# EAGLE design Lora- 4 Channel MOSFET Driver V1.1 (EAGLE 6.1)
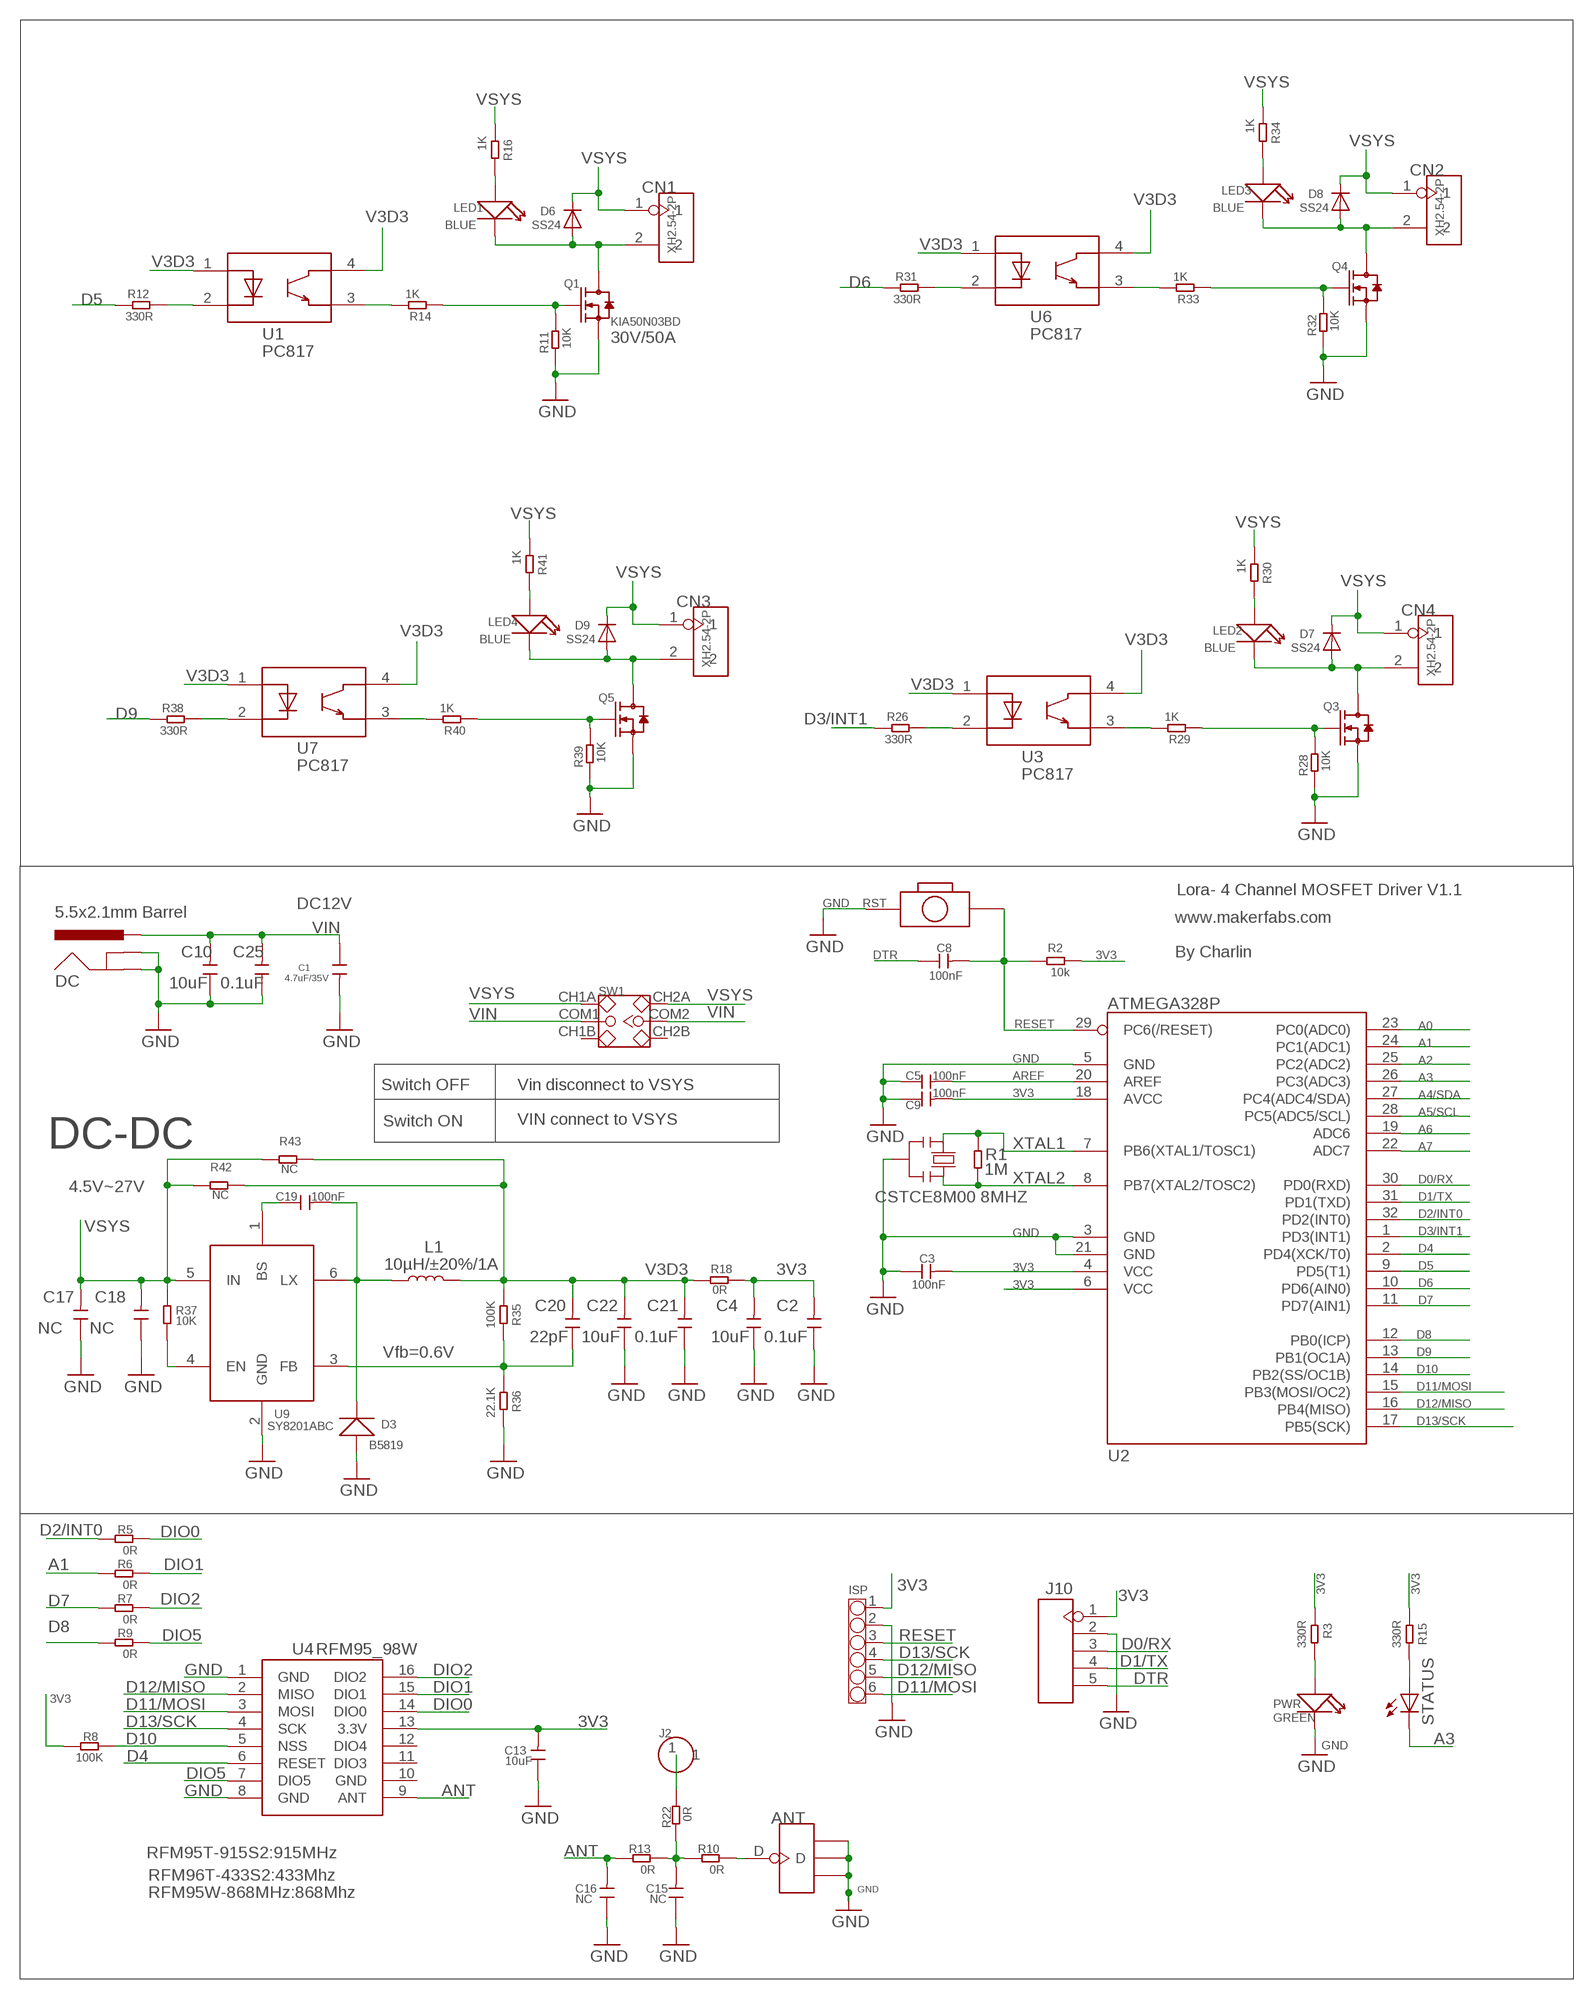
[diagram p0: schematic, sheet 1]

## Parts
ANT  ANTENNA-U-FL  [4P-U-FL]
C1  4.7uF/35V  C-0603  [0603]
C2  0.1uF  C-0603  [0603]
C3  100nF  C-0603  [0603]
C4  10uF  C-0603  [0603]
C5  100nF  C-0603  [0603]
C8  100nF  C-0603  [0603]
C9  100nF  C-0603  [0603]
C10  10uF  C-0603  [0603]
C13  10uF  C-0603  [0603]
C15  NC  C-0603  [0603]
C16  NC  C-0603  [0603]
C17  NC  C-0603  [0603]
C18  NC  C-0603  [0603]
C19  100nF  C-0603  [0603]
C20  22pF  C-0603  [0603]
C21  0.1uF  C-0603  [0603]
C22  10uF  C-0603  [0603]
C25  0.1uF  C-0603  [0603]
CN1  XH2.54-2P  [XH2.54-2P]
CN2  XH2.54-2P  [XH2.54-2P]
CN3  XH2.54-2P  [XH2.54-2P]
CN4  XH2.54-2P  [XH2.54-2P]
D3  B5819  D'1206'  [SOD123]
D6  SS24  DIODESMA  [SMADIODE]
D7  SS24  DIODESMA  [SMADIODE]
D8  SS24  DIODESMA  [SMADIODE]
D9  SS24  DIODESMA  [SMADIODE]
DC  5.5x2.1mm Barrel  POWER_JACKSMD  [POWER_JACK_SMD]
ISP  CONNECTOR-HEADER-6P-3460270P1  [1X6P-2.54-8.5-BLACK-FEMALE]
J2  HEADER-1P-50  [1P-100/50MIL]
J10  HEADER-5P-2.54  [5P-2.54]
L1  10µH/±20%/1A  INDUCTOR-SRN6045-33UH  [SRN6045]
LED1  BLUE  LED'0603'  [LED-0603]
LED2  BLUE  LED'0603'  [LED-0603]
LED3  BLUE  LED'0603'  [LED-0603]
LED4  BLUE  LED'0603'  [LED-0603]
PWR  GREEN  LED'0603'  [LED-0603]
Q1  KIA50N03BD  DISCRETE_MOSFET-NP3055LDG  [DISCRETE_TO252]
Q3  DISCRETE_MOSFET-NP3055LDG  [DISCRETE_TO252]
Q4  DISCRETE_MOSFET-NP3055LDG  [DISCRETE_TO252]
Q5  DISCRETE_MOSFET-NP3055LDG  [DISCRETE_TO252]
R1  1M  R-0603  [R0603]
R2  10k  R-0603  [R0603]
R3  330R  R-0603  [R0603]
R5  0R  R-0603  [R0603]
R6  0R  R-0603  [R0603]
R7  0R  R-0603  [R0603]
R8  100K  R-0603  [R0603]
R9  0R  R-0603  [R0603]
R10  0R  R-0603  [R0603]
R11  10K  R-0603  [R0603]
R12  330R  R-0603  [R0603]
R13  0R  R-0603  [R0603]
R14  1K  R-0603  [R0603]
R15  330R  R-0603  [R0603]
R16  1K  R-0603  [R0603]
R18  0R  R-0603  [R0603]
R22  0R  R-0603  [R0603]
R26  330R  R-0603  [R0603]
R28  10K  R-0603  [R0603]
R29  1K  R-0603  [R0603]
R30  1K  R-0603  [R0603]
R31  330R  R-0603  [R0603]
R32  10K  R-0603  [R0603]
R33  1K  R-0603  [R0603]
R34  1K  R-0603  [R0603]
R35  100K  R-0603  [R0603]
R36  22.1K  R-0603  [R0603]
R37  10K  R-0603  [R0603]
R38  330R  R-0603  [R0603]
R39  10K  R-0603  [R0603]
R40  1K  R-0603  [R0603]
R41  1K  R-0603  [R0603]
R42  NC  R-0603  [R0603]
R43  NC  R-0603  [R0603]
RST  BOTTON-2P-90D  [2P-7.62X3.56-90D]
STATUS  LED5MM  [LED5MM]
SW1  SWITCH-2CH-6P  [6P-2CH-2.54-7.6X3.0]
U1  PC817  [SMD4-254P-1016L460W]
U2  ATMEGA328P  ATMEGA8/168/328  [TQFP32]
U3  PC817  [SMD4-254P-1016L460W]
U4  RFM95_98W  RFM92_93W  [RFM92_93W]
U6  PC817  [SMD4-254P-1016L460W]
U7  PC817  [SMD4-254P-1016L460W]
U9  SY8201ABC  [SOT-23-6]
Y1  CSTCE8M00 8MHZ  RESONATORMU  [RESONATOR]

## Nets
3V3: C2.2 C3.2 C4.2 C9.2 C13.2 ISP.1 J10.1 R2.1 R3.1 R8.2 R15.1 R18.2 U2.4(VCC) U2.6(VCC) U2.18(AVCC) U4.13(3.3V)
A0: U2.23(PC0(ADC0))
A1: R6.1 U2.24(PC1(ADC1))
A2: U2.25(PC2(ADC2))
A3: STATUS.K(C) U2.26(PC3(ADC3))
A4/SDA: U2.27(PC4(ADC4/SDA))
A5/SCL: U2.28(PC5(ADC5/SCL))
A6: U2.19(ADC6)
A7: U2.22(ADC7)
ANT: C16.2 R13.2 U4.9(ANT)
AREF: C5.2 U2.20(AREF)
D0/RX: J10.3 U2.30(PD0(RXD))
D1/TX: J10.4 U2.31(PD1(TXD))
D2/INT0: R5.1 U2.32(PD2(INT0))
D3/INT1: R26.1 U2.1(PD3(INT1))
D4: U2.2(PD4(XCK/T0)) U4.6(RESET)
D5: R12.1 U2.9(PD5(T1))
D6: R31.1 U2.10(PD6(AIN0))
D7: R7.1 U2.11(PD7(AIN1))
D8: R9.1 U2.12(PB0(ICP))
D9: R38.1 U2.13(PB1(OC1A))
D10: R8.1 U2.14(PB2(SS/OC1B)) U4.5(NSS)
D11/MOSI: ISP.6 U2.15(PB3(MOSI/OC2)) U4.3(MOSI)
D12/MISO: ISP.5 U2.16(PB4(MISO)) U4.2(MISO)
D13/SCK: ISP.4 U2.17(PB5(SCK)) U4.4(SCK)
DIO0: R5.2 U4.14(DIO0)
DIO1: R6.2 U4.15(DIO1)
DIO2: R7.2 U4.16(DIO2)
DIO5: R9.2 U4.7(DIO5)
DTR: C8.1 J10.5
GND: ANT.GND1 ANT.GND2 ANT.GND3 C1.2 C2.1 C3.1 C4.1 C5.1 C9.1 C10.1 C13.1 C15.1 C16.1 C17.1 C18.1 C21.1 C22.1 C25.1 D3.+ DC.GND(GNDBREAK) DC.P$4(GND) ISP.2 J10.2 PWR.- Q1.3(S) Q3.3(S) Q4.3(S) Q5.3(S) R11.1 R28.1 R32.1 R36.2 R39.1 RST.P$1 U2.3(GND) U2.5(GND) U2.21(GND) U4.1(GND) U4.8(GND) U9.2(GND) Y1.2
N$1: ANT.D R10.1
N$2: R12.2 U1.2
N$4: C15.2 R10.2 R13.1 R22.2
N$5: R15.2 STATUS.A
N$6: Q1.1(G) R11.2 R14.1
N$7: PWR.+ R3.2
N$12: J2.1 R22.1
N$13: CN1.2 D6.A LED1.- Q1.2(D)
N$14: R14.2 U1.3
N$18: R26.2 U3.2
N$19: Q3.1(G) R28.2 R29.1
N$20: LED1.+ R16.2
N$21: R29.2 U3.3
N$22: CN4.2 D7.A LED2.- Q3.2(D)
N$23: LED2.+ R30.2
N$25: R31.2 U6.2
N$26: C19.2 D3.- L1.1 U9.6(LX)
N$27: C19.1 U9.1(BS)
N$28: C20.1 R35.2 R36.1 U9.3(FB)
N$29: Q4.1(G) R32.2 R33.1
N$30: R33.2 U6.3
N$31: CN2.2 D8.A LED3.- Q4.2(D)
N$32: LED3.+ R34.2
N$33: R38.2 U7.2
N$34: Q5.1(G) R39.2 R40.1
N$35: R40.2 U7.3
N$36: CN3.2 D9.A LED4.- Q5.2(D)
N$37: LED4.+ R41.2
N$38: R37.2 U9.4(EN)
RESET: C8.2 ISP.3 R2.2 RST.P$2 U2.29(PC6(/RESET))
V3D3: C20.2 C21.2 C22.2 L1.2 R18.1 R35.1 R42.2 R43.2 U1.1 U1.4 U3.1 U3.4 U6.1 U6.4 U7.1 U7.4
VIN: C1.1 C10.2 C25.2 DC.VIN0(PWR) SW1.COM1 SW1.COM2
VSYS: C17.2 C18.2 CN1.1 CN2.1 CN3.1 CN4.1 D6.C D7.C D8.C D9.C R16.1 R30.1 R34.1 R37.1 R41.1 R42.1 R43.1 SW1.CH1A SW1.CH2A U9.5(IN)
XTAL1: R1.2 U2.7(PB6(XTAL1/TOSC1)) Y1.1
XTAL2: R1.1 U2.8(PB7(XTAL2/TOSC2)) Y1.3
Unconnected: SW1.CH1B SW1.CH2B U4.11(DIO3) U4.12(DIO4)

## Notes on the sheet
- 30V/50A
- Lora- 4 Channel MOSFET Driver V1.1
- DC12V
- www.makerfabs.com
- By Charlin
- Switch OFF | Vin disconnect to VSYS
- Switch ON | VIN connect to VSYS
- DC-DC
- 4.5V~27V
- Vfb=0.6V
- RFM95T-915S2:915MHz
- RFM96T-433S2:433Mhz
- RFM95W-868MHz:868Mhz

## Power pins joined to a net without a drawn wire
GND: U4.10(GND)

## Library data of the parts
ANT = Connector:ANTENNA-U-FL
C1-C5 C8-C10 C13 C15-C22 C25 = Discrete:C*: Ceramic Capacitors
CN1-CN4 = Connector:XH2.54-2P
D3 = Discrete:D*
D6-D9 = adafruit:DIODE: Diode SMADIODE - SMA Surface Mount Package 20V 1A Schottky Diode Digikey: 641-1014-6-ND DO-1N4148 - Through Hole Small Current Diode SOD-123 20V 1 A (.5mV Vf) Schottky Diode - Digikey: MBRX120TPMSCT-ND SOD-323 10V 570mA (.38mV Vf, 3ns) Schottky Diode - Digikey: ZLLS410CT-ND SOD-523 30V 30mA Schottky Diode (RB751S-40TE61) - Digikey: RB751S-40TE61CT-ND SOT23-R/W - SOT23 Package (R = Solder Paste/Reflow Ovens, W = Hand-Soldering) BAT54Film 40V 300mA - Digikey: 497-7162-1-ND
DC = SparkFun-Connectors:POWER_JACK: Power Jack Connector This is the standard 5.5mm barrel jack for power. The PTH is the most common, proven, reliable, footprint. The Slot footprint only works if the mill layer is transmitted to the PCB fab house so be warned. Here are the connectors we sell at SparkFun: DC Barrel Power Jack/Connector <https://www.sparkfun.com/products/119> (PRT-00119) DC Barrel Power Jack/Connector (SMD) <https://www.sparkfun.com/products/12748> (PRT-12748) DC Barrel Jack Adapter - Breadboard Compatible <https://www.sparkfun.com/products/10811> (PRT-10811) It is used on this SparkFun product (and many, many others): SparkFun RedBoard - Programmed with Arduino <https://www.sparkfun.com/products/12757> (DEV-12757) Also, if you need a mating power supply or connector, please check these out: Wall Adapter Power Supply - 9VDC 650mA <https://www.sparkfun.com/products/298> (TOL-00298) DC Barrel Jack Adapter - Male <https://www.sparkfun.com/products/10287> (PRT-10287); PROD_ID: CONN-08106; SF_ID: PRT-12748
ISP = OPL Eagle Library:CONNECTOR-HEADER-6P
J2 = Connector:HEADER-1P
J10 = Connector:HEADER-5P
L1 = SparkFun-Coils:INDUCTOR: Inductors Resist changes in electrical current. Basically a coil of wire. SparkFun Products: SparkFun Load Cell Amplifier - HX711 <https://www.sparkfun.com/products/13879> IOIO-OTG - V2.2 <https://www.sparkfun.com/products/13613>; PROD_ID: NDUC-11627; VALUE: 33µH/±20%/1.4A
LED1-LED4 PWR = Discrete:LED*
Q1 Q3-Q5 = A9G:DISCRETE_MOSFET-N: IRLL014: http://www.vishay.com/docs/91319/sihll014.pdf
R1-R3 R5-R16 R18 R22 R26 R28-R43 = Discrete:R*
RST = Discrete:BOTTON-2P
STATUS = led:LED: LED OSRAM: - CHIPLED LG R971, LG N971, LY N971, LG Q971, LY Q971, LO R971, LY R971 LH N974, LH R974 LS Q976, LO Q976, LY Q976 LO Q996 - Hyper CHIPLED LW Q18S LB Q993, LB Q99A, LB R99A - SideLED LS A670, LO A670, LY A670, LG A670, LP A670 LB A673, LV A673, LT A673, LW A673 LH A674 LY A675 LS A676, LA A676, LO A676, LY A676, LW A676 LS A679, LY A679, LG A679 - Hyper Micro SIDELED® LS Y876, LA Y876, LO Y876, LY Y876 LT Y87S - SmartLED LW L88C, LW L88S LB L89C, LB L89S, LG L890 LS L89K, LO L89K, LY L89K LS L896, LA L896, LO L896, LY L896 - TOPLED LS T670, LO T670, LY T670, LG T670, LP T670 LSG T670, LSP T670, LSY T670, LOP T670, LYG T670 LG T671, LOG T671, LSG T671 LB T673, LV T673, LT T673, LW T673 LH T674 LS T676, LA T676, LO T676, LY T676, LB T676, LH T676, LSB T676, LW T676 LB T67C, LV T67C, LT T67C, LS T67K, LO T67K, LY T67K, LW E67C LS E67B, LA E67B, LO E67B, LY E67B, LB E67C, LV E67C, LT E67C LW T67C LS T679, LY T679, LG T679 LS T770, LO T770, LY T770, LG T770, LP T770 LB T773, LV T773, LT T773, LW T773 LH T774 LS E675, LA E675, LY E675, LS T675 LS T776, LA T776, LO T776, LY T776, LB T776 LHGB T686 LT T68C, LB T68C - Hyper Mini TOPLED® LB M676 - Mini TOPLED Santana® LG M470 LS M47K, LO M47K, LY M47K Source: http://www.osram.convergy.de LUXEON: - LUMILED® LXK2-PW12-R00, LXK2-PW12-S00, LXK2-PW14-U00, LXK2-PW14-V00 LXK2-PM12-R00, LXK2-PM12-S00, LXK2-PM14-U00 LXK2-PE12-Q00, LXK2-PE12-R00, LXK2-PE12-S00, LXK2-PE14-T00, LXK2-PE14-U00 LXK2-PB12-K00, LXK2-PB12-L00, LXK2-PB12-M00, LXK2-PB14-N00, LXK2-PB14-P00, LXK2-PB14-Q00 LXK2-PR12-L00, LXK2-PR12-M00, LXK2-PR14-Q00, LXK2-PR14-R00 LXK2-PD12-Q00, LXK2-PD12-R00, LXK2-PD12-S00 LXK2-PH12-R00, LXK2-PH12-S00 LXK2-PL12-P00, LXK2-PL12-Q00, LXK2-PL12-R00 Source: www.luxeon.com KINGBRIGHT: KA-3528ASYC Source: www.kingbright.com
SW1 = Discrete:SWITCH-2CH-6P
U1 U3 U6 U7 = self:PC817
U2 = IC:ATMEGA8/168/328: MICROCONTROLLER
U4 = dragino:RFM92_93W
U9 = self:SY8201ABC
Y1 = SmartPrj:RESONATOR

## Net classes
0 default: width 0.152 mm, drill 0.305 mm, clearance 0.152 mm
1 AC High Current: width 2.54 mm, drill 25.4 mm, clearance 1.27 mm
2 gnd: width 0.305 mm, drill 0.559 mm, clearance 0.254 mm
3 usbvcc: width 0.508 mm, drill 0.61 mm, clearance 0.254 mm

## Board
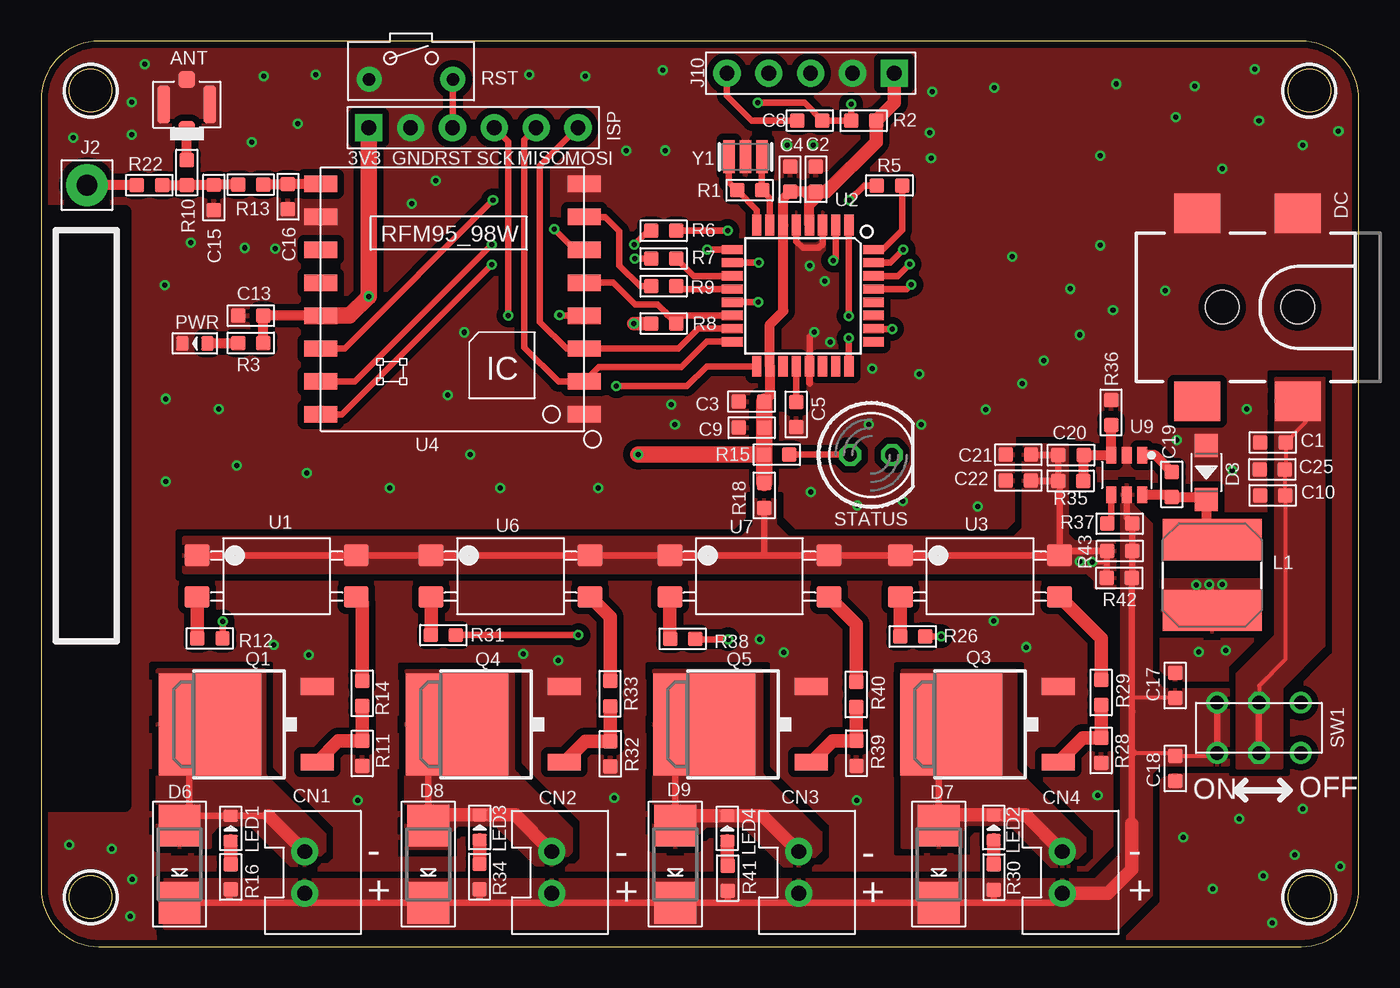
[diagram p1: board, top side]
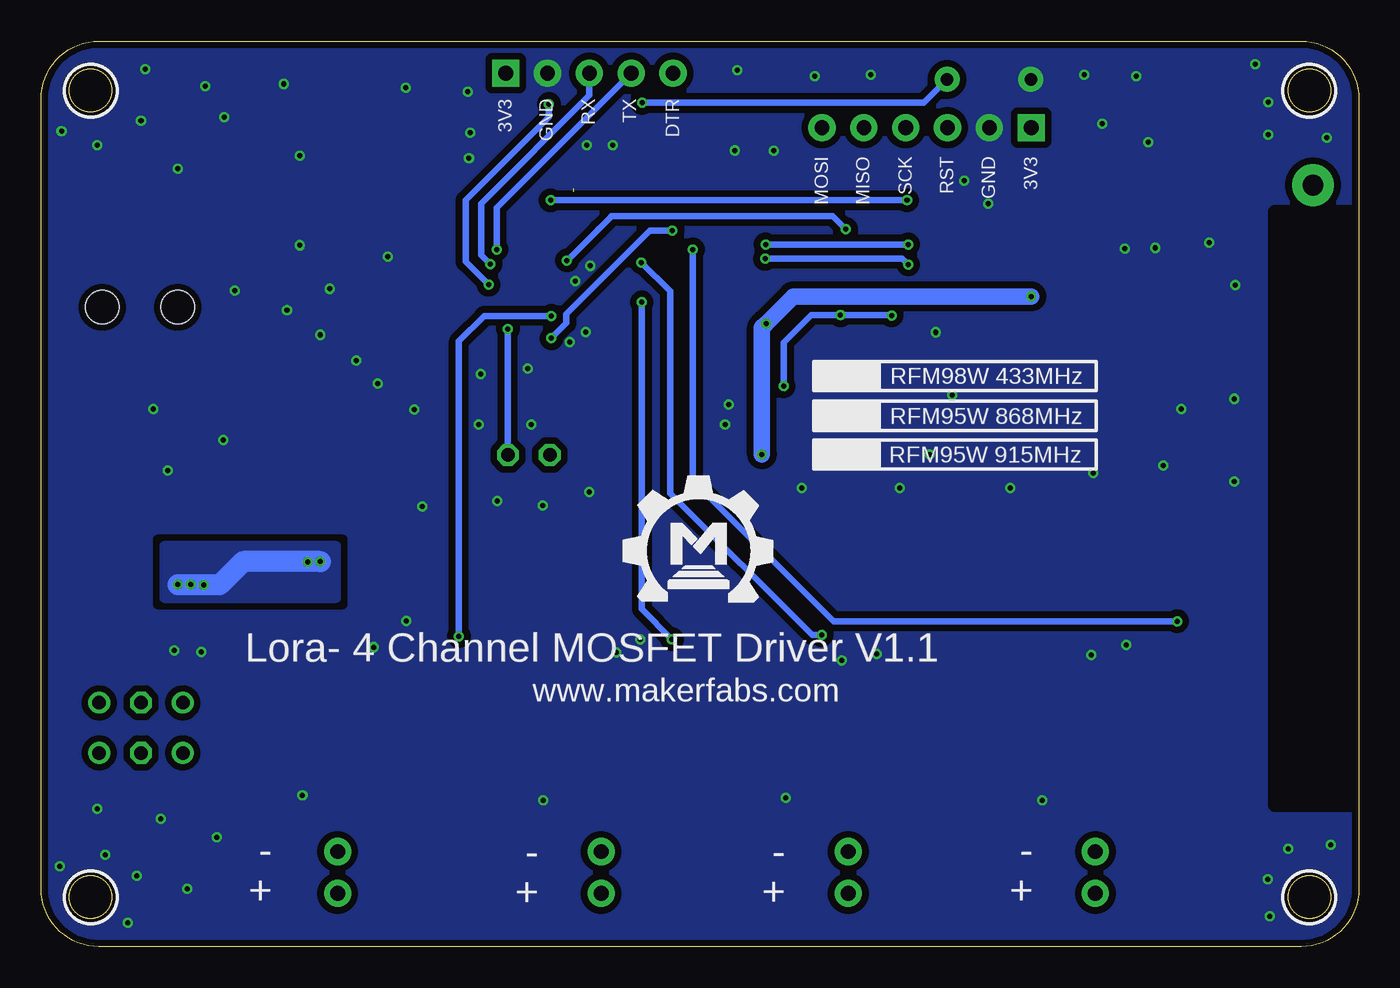
[diagram p2: board, bottom side, seen from below]

Size 80 x 55 mm. Coordinates in mm from the lower left corner, seen from the top.
Outline: 3.5,0 76.5,0 arc90 80,3.5 80,51.5 arc90 76.5,55 3.5,55 arc90 0,51.5 0,3.5 arc90 3.5,0
Outline: circle at 77,3 radius 1.3
Outline: circle at 77,52 radius 1.3
Outline: circle at 3,3 radius 1.3
Outline: circle at 3,52 radius 1.3
Copper layers (1*16): Top 0.035mm / dielectric 1.5mm / Bottom 0.035mm
Design rules: minimum track width 6mil, minimum drill 12mil, track to track 6mil, track to pad 6mil, pad to pad 6mil, via to via 6mil, smd to smd 0mil, copper to edge 10mil, drill to drill 10mil, minimum pad ring 10mil, minimum via ring 6mil, stop-mask expansion 2mil, vias tented up to drill 100mil, thermal gap 0mil
tRestrict: area 0.4,8.6 to 5.1,44.6
bRestrict: area 0.4,8.6 to 5.1,44.6

### Footprints (pad centres in the part's own frame; a part is rotated, then mirrored left to right if it is on the bottom)
4P-U-FL = smd 1.016 x 1.016: D -1.524,0; GND3 1.524,0 | smd 2.286 x 0.762: GND1 0,1.397; GND2 0,-1.397
0603 = smd 0.889 x 0.889: 1 -0.762,0; 2 0.762,0
XH2.54-2P = drill 0.9 pad 1.651: 1 -1.27,0; 2 1.27,0
SOD123 = smd 1.397 x 1.397: + -1.651,0; - 1.651,0
SMADIODE = smd 2.54 x 2.54: A 2.349,0; C -2.349,0
POWER_JACK_SMD = smd 2.8 x 2.4: GND 0,-5.7; P$4 6.1,-5.7; VIN0 0,5.7; VIN1 6.1,5.7 | hole 2.032: 0,0; 4.572,0
1X6P-2.54-8.5-BLACK-FEMALE = drill 0.889 pad 1.651 square: 1 0,6.35 | drill 0.889 pad 1.651: 2 0,3.81; 3 0,1.27; 4 0,-1.27; 5 0,-3.81; 6 0,-6.35
1P-100/50MIL = drill 1.27 pad 2.54: 1 0,0
5P-2.54 = drill 0.889 pad 1.651 square: 1 0,5.08 | drill 0.889 pad 1.651: 2 0,2.54; 3 0,0; 4 0,-2.54; 5 0,-5.08
SRN6045 = smd 2.5 x 6: 1 -2.175,0; 2 2.125,0
LED-0603 = smd 0.762 x 0.889: + -0.762,0; - 0.762,0
DISCRETE_TO252 = smd 1.016 x 2: 1 -2.3,-4.75; 3 2.3,-4.75 | smd 6.2 x 6.2: 2 0,1.75
R0603 = smd 0.889 x 0.889: 1 -0.762,0; 2 0.762,0
2P-7.62X3.56-90D = drill 0.762 pad 1.524: P$1 0,2.54; P$2 0,-2.54
LED5MM = drill 0.813 octagon: A -1.27,0; K 1.27,0
6P-2CH-2.54-7.6X3.0 = drill 0.813 pad 1.27: CH1A -1.524,2.54; CH1B -1.524,-2.54; CH2A 1.524,2.54; CH2B 1.524,-2.54 | drill 0.813 pad 1.27 octagon: COM1 -1.524,0; COM2 1.524,0
SMD4-254P-1016L460W = smd 1.5 x 1.3: 1 -4.83,1.27; 2 -4.83,-1.27; 3 4.83,-1.27; 4 4.83,1.27
TQFP32 = smd 1.27 x 0.559: 1 -4.293,2.8; 2 -4.293,2; 3 -4.293,1.2; 4 -4.293,0.4; 5 -4.293,-0.4; 6 -4.293,-1.2; 7 -4.293,-2; 8 -4.293,-2.8; 17 4.293,-2.8; 18 4.293,-2; 19 4.293,-1.2; 20 4.293,-0.4; 21 4.293,0.4; 22 4.293,1.2; 23 4.293,2; 24 4.293,2.8 | smd 0.559 x 1.27: 9 -2.8,-4.293; 10 -2,-4.293; 11 -1.2,-4.293; 12 -0.4,-4.293; 13 0.4,-4.293; 14 1.2,-4.293; 15 2,-4.293; 16 2.8,-4.293; 25 2.8,4.293; 26 2,4.293; 27 1.2,4.293; 28 0.4,4.293; 29 -0.4,4.293; 30 -1.2,4.293; 31 -2,4.293; 32 -2.8,4.293
RFM92_93W = smd 2 x 1: 1 -8,7; 2 -8,5; 3 -8,3; 4 -8,1; 5 -8,-1; 6 -8,-3; 7 -8,-5; 8 -8,-7; 9 8,-7; 10 8,-5; 11 8,-3; 12 8,-1; 13 8,1; 14 8,3; 15 8,5; 16 8,7
SOT-23-6 = smd 1 x 0.6: 1 -1.2,0.95; 2 -1.2,0; 3 -1.2,-0.95; 4 1.2,-0.95; 5 1.2,0; 6 1.2,0.95
RESONATOR = smd 0.7 x 2: 1 -1,0; 2 0,0; 3 1,0

### Placement (x,y rotation side)
ANT  8.84,51.15 90 top
C1  74.79,30.63 180 top
C2  47.04,46.61 270 top
C3  43.13,33.11 0 top
C4  45.47,46.61 270 top
C5  45.84,32.33 90 top
C8  46.67,50.17 0 top
C9  43.13,31.52 0 top
C10  74.76,27.41 0 top
C13  12.73,38.33 0 top
C15  10.48,45.51 90 top
C16  14.98,45.55 90 top
C17  68.85,15.86 270 top
C18  68.87,10.82 90 top
C19  68.64,28.08 270 top
C20  62.53,29.86 180 top
C21  59.33,29.88 0 top
C22  59.33,28.31 0 top
C25  74.75,28.98 0 top
CN1  16,4.5 90 top
CN2  31,4.5 90 top
CN3  46,4.5 90 top
CN4  62,4.5 90 top
D3  70.74,28.8 270 top
D6  8.4,5 90 top
D7  54.5,5 90 top
D8  23.5,5 90 top
D9  38.5,5 90 top
DC  76.29,38.83 180 top
ISP  26.24,49.74 90 top
J2  2.78,46.25 270 top
J10  46.72,53.05 270 top
L1  71.09,22.54 270 top
LED1  11.5,7.18 90 top
LED2  57.83,7.23 90 top
LED3  26.62,7.24 90 top
LED4  41.66,7.18 90 top
PWR  9.33,36.64 180 top
Q1  12,13.5 90 top
Q3  57,13.5 90 top
Q4  27,13.5 90 top
Q5  42,13.5 90 top
R1  43.01,45.94 0 top
R2  49.94,50.16 180 top
R3  12.73,36.67 180 top
R5  51.51,46.24 180 top
R6  37.8,43.48 180 top
R7  37.8,41.8 180 top
R8  37.8,37.85 180 top
R9  37.8,40.11 180 top
R10  8.84,47.02 270 top
R11  19.49,11.73 90 top
R12  10.25,18.72 180 top
R13  12.72,46.28 0 top
R14  19.49,15.39 90 top
R15  44.67,29.89 0 top
R16  11.5,4.24 90 top
R18  43.89,27.41 90 top
R22  6.58,46.25 0 top
R26  52.92,18.83 180 top
R28  64.35,11.92 90 top
R29  64.35,15.44 90 top
R30  57.85,4.22 90 top
R31  24.42,18.92 180 top
R32  34.56,11.72 90 top
R33  34.54,15.36 90 top
R34  26.61,4.25 90 top
R35  62.51,28.29 0 top
R36  64.96,32.45 90 top
R37  65.48,25.69 180 top
R38  38.94,18.69 180 top
R39  49.5,11.74 90 top
R40  49.48,15.31 90 top
R41  41.68,4.15 90 top
R42  65.46,22.38 180 top
R43  65.49,24.03 180 top
RST  22.46,52.68 90 top
STATUS  50.39,29.87 0 top
SW1  73.94,13.29 90 top
U1  14.3,22.5 0 top
U2  46.24,39.54 270 top
U3  57,22.5 0 top
U4  24.98,39.33 180 top
U6  28.5,22.5 0 top
U7  43,22.5 0 top
U9  65.91,28.65 270 top
U$1  [MAKERFABS_0.3]  44.21,20.97 0 bottom
Y1  42.76,47.97 180 top

### Tracks (layer width: path | path; a pad name or v marks a point on that pad's centre or on a via)
3V3  (via drill 0.3)  (1 unrouted)
  Top 0.406: R15.1
  Top 0.61: U4.13 | U4.13 C13.2 R3.1 | C3.2 44.24,33.46 U2.18 44.24,37.79 45.06,38.61 45.06,43.81 U2.6 45.04,45.42 C4.2 46.3,45.85 | C2.2 46.3,45.85 | U2.4 46.64,45.51 46.3,45.85 | 47.9,46.05 47.68,46.05 46.69,45.06
  Top 0.813: J10.1 51.8,51.26 R2.1 50.7,48.87 47.68,45.85 C2.2 | R8.2 v36,37.85 v35.99,37.85
  Top 1.016: U4.13 18.72,38.33 v19.89,39.5 ISP.1 | R15.1 36.26,29.89 v36.25,29.9 | R18.2 43.89,29.87 R15.1 | R15.1 43.9,31.51 C9.2 C3.2
  Bottom 1.016: v19.89,39.5 34.34,39.5 v35.99,37.85 36.25,37.59 v36.25,29.9
A1  (via drill 0.3)
  Top 0.406: R6.1 v41.68,43.48 | v49.02,36.96 49.02,35.27 U2.24
  Bottom 0.406: v41.68,43.48 43.05,43.48 48.11,38.43 48.11,37.87 v49.02,36.96
A3  (via drill 0.3)
  Top 0.406: v51.66,37.52 50.56,37.52 U2.26
  Bottom 0.406: STATUS.K v51.66,37.51 v51.66,37.52
ANT
  Top 0.61: U4.9 16.97,46.31 C16.2 14.96,46.28 R13.2
AREF
  Top 0.406: U2.20 C5.2
D0/RX  (via drill 0.3)
  Top 0.406: U2.30 52.02,40.74 v52.73,41.45
  Bottom 0.406: J10.3 46.71,51.71 53.29,45.14 53.29,42.01 v52.73,41.45
D1/TX  (via drill 0.3)
  Top 0.406: U2.31 51.55,41.54 v52.35,42.34
  Bottom 0.406: J10.4 52.35,44.88 v52.35,42.34
D2/INT0
  Top 0.406: U2.32 51.1,42.34 52.27,43.51 R5.1
D3/INT1  (via drill 0.3)
  Top 0.406: R26.1 54.62,18.83 v54.63,18.85 | U2.1 49.02,43.81 v49.02,38.3
  Bottom 0.406: v54.63,18.85 54.63,36.78 53.11,38.3 v49.02,38.3
D4  (via drill 0.3)
  Top 0.406: U2.2 48.23,41.83 v48.08,41.68 | U4.6 32.4,42.33 v31.14,43.59
  Bottom 0.406: v31.14,43.59 31.93,44.37 45.39,44.37 45.39,44.35 46.18,43.56 | 48.03,41.71 48.06,41.68 v48.08,41.68 48.03,41.68 | 48.03,41.68 48.01,41.71 | 48.03,41.68 48.06,41.66 48.06,41.73 48.03,41.73 48.01,41.71 | 46.18,43.59 46.18,43.56 | 46.18,43.56 48.03,41.71 | 48.03,41.71 48.01,41.71 | 48.01,41.71 48.01,41.68
D5  (via drill 0.3)
  Top 0.406: R12.1 11.01,19.75 v11.02,19.76 | U2.9 v40.44,42.34
  Bottom 0.406: v11.02,19.76 31.88,19.76 40.44,28.32 v40.44,42.34
D6  (via drill 0.3)
  Top 0.406: R31.1 v32.61,18.92 | v43.56,41.55 41.96,41.55 U2.10
  Bottom 0.406: v32.61,18.92 33.2,18.92 41.81,27.53 41.81,39.8 v43.56,41.55
D7
  Top 0.406: U2.11 39.62,40.74 R7.1
D8
  Top 0.406: U2.12 38.73,39.94 R9.1
D9  (via drill 0.3)
  Top 0.406: U2.13 v43.53,39.14 v43.54,39.14 | v41.71,18.67 39.73,18.67 R38.1
  Bottom 0.406: v43.54,39.14 43.54,20.5 v41.71,18.67
D10
  Top 0.406: U4.5 34.73,40.33 36.07,38.99 37.42,38.99 37.85,38.56 38.07,38.34 | 38.07,38.34 R8.1 | U2.14 38.07,38.34
D11/MOSI
  Top 0.406: ISP.6 30.28,47.43 30.28,37.95 31.9,36.33 U4.3 38.69,36.33 39.9,37.54 U2.15
D12/MISO
  Top 0.406: ISP.5 29.34,49.03 29.34,36.4 31.42,34.31 32.97,34.31 U4.2 33.86,35.2 38.86,35.2 40.4,36.74 U2.16
D13/SCK  (via drill 0.3)
  Top 0.406: ISP.4 28.37,48.88 v28.37,38.33 | v31.47,38.35 31.5,38.33 U4.4 | U2.17 40.4,35.25 39.19,34.04 v34.92,34.04
  Bottom 0.406: v28.37,38.33 28.4,38.35 v31.47,38.35 33.25,38.35 34.92,36.68 v34.92,34.04
DIO0  (via drill 0.3)
  Top 0.406: R5.2 49.97,46.24 v49.07,45.34 | U4.14 18.42,36.33 v27.43,45.34
  Bottom 0.406: v49.07,45.34 v27.43,45.34
DIO1  (via drill 0.3)
  Top 0.406: v36.02,42.65 36.85,43.48 R6.2 | U4.15 19.04,34.33 v27.36,42.65
  Bottom 0.406: v27.36,42.65 v36.02,42.65
DIO2  (via drill 0.3)
  Top 0.406: U4.16 18.25,32.33 v27.36,41.43 | R7.2 36.06,41.8 v36.04,41.78
  Bottom 0.406: v36.04,41.78 27.71,41.78 v27.36,41.43
DIO5
  Top 0.406: R9.2 36.37,40.11 35.1,41.38 35.1,43.46 34.24,44.32 U4.7
DTR
  Top 0.406: J10.5 41.63,51.68 43.16,50.16 C8.1
GND  (via drill 0.3)
  Top 0.406: v46.94,37.34 46.66,37.06 46.66,34.21 46.64,34.23 U2.21 | U2.5 45.84,42.83 46.23,42.44 47.22,42.44 47.45,42.67 U2.3
  other vias: 11.89,29.21 21.16,27.86 27.86,27.86 33.83,27.86 24.69,33.5 60.86,35.59 64.31,48.06 68.88,50.39 76.61,48.69 65.28,52.4 68.25,39.85 64.31,42.6 71.12,3.51 72.75,7.75 76.61,8.36 69.34,6.63 59.82,18.19 49.53,8.89 64.14,9.19 45.09,17.88 31.39,17.37 34.8,9.04 16.26,17.73 19.23,8.89 12.37,42.44 9.09,42.75 14.2,42.39 12.78,48.87 15.57,49.99 16.66,52.96 6.3,53.59 5.51,49.33 1.96,49.12 33.05,52.88 37.74,53.24 37.9,48.36 22.5,45.14 23.95,46.53 47.57,40.44 47.9,36.73 46.74,27.61 59.56,34.21 57.35,32.61 68.94,30.76 72.31,28.93 73.2,32.66 70.28,17.91 65.07,38.66 53.95,49.43 35.53,48.34 45.29,48.69 46.66,41.35 52.3,27.08 49.56,26.8 38.25,32.92 29.64,52.96 10.77,32.64 16.13,28.78 26.06,29.9 43.64,18.67 57.84,19.79 29.26,17.78 14.12,18.31 50.44,35.1 50.24,31.72 53.31,34.77 53.44,31.7 56.87,26.75 62.48,39.95 63.04,37.16 7.49,40.18 7.57,28.24 7.57,33.27 5.41,1.83 5.54,4.09 4.29,5.94 1.7,6.17 73.69,53.29 73.94,50.16 78.77,49.53 70.03,52.27 71.7,47.24 54.1,51.92 57.86,52.17 13.51,52.86 5.49,51.28 25.68,37.31 74.75,1.45 74.19,4.29 76.1,5.56 78.87,4.88 71.91,17.98 58.95,41.91 54.03,47.9 46.86,48.69 38.48,31.7
  pour Bottom (isolate 0.406, rank 6): -1.06,60 85,60 85,-1 -1,-1 -1.06,51.62
  pour Top (isolate 0.406, rank 6): -1.06,60 85,60 85,-1 -1,-1 -1.07,51.68
N$1
  Top 0.61: R10.1 ANT.D
N$2
  Top 0.813: U1.2 9.47,18.73 R12.2
N$4
  Top 0.61: R13.1 11.94,46.27 C15.2 10.47,46.26 R10.2 R22.2
N$5
  Top 0.406: R15.2 49.1,29.89 STATUS.A
N$6
  Top 0.813: R14.1 R11.2 18.04,12.49 Q1.1
N$7
  Top 0.61: PWR.+ 10.12,36.67 R3.2
N$12
  Top 0.61: R22.1 J2.1
N$13
  Top 0.406: Q1.2 9,12.25 9,7.98 | 13.83,7.94 LED1.- 8.99,7.94 D6.A
  Top 0.813: CN1.2 13.83,7.94
  pour Top: 15.14,4.98 16.36,4.98 17.22,5.84 17.22,6.78 13.59,10.41 13.59,16.76 7.06,16.76 7.06,6.05 10.26,6.05 10.26,6.88 10.79,7.42 12.7,7.42
N$14
  Top 0.813: R14.2 19.49,20.87 U1.3
N$18
  Top 0.813: U3.2 52.17,18.85 R26.2
N$19
  Top 0.813: R29.1 R28.2 63.23,12.68 Q3.1
N$20
  Top 0.813: R16.2 LED1.+
N$21
  Top 0.813: R29.2 64.35,18.71 U3.3
N$22
  Top 0.406: Q3.2 54.5,12.75 D7.A
  Top 0.813: CN4.2 59.78,7.99 LED2.- 55.15,7.99 D7.A
  pour Top: 62.43,4.9 63.37,5.84 63.37,6.55 59.18,10.74 59.18,16.56 59.18,16.74 52.27,16.74 52.27,6.07 55.91,6.07 55.91,7.11 56.24,7.44 58.8,7.44 61.34,4.9
N$23
  Top 0.813: R30.2 57.83,5 LED2.+
N$25
  Top 0.813: U6.2 23.67,18.93 R31.2
N$26
  Top 0.61: U9.6 68.5,27.45 C19.2 70.58,27.31 D3.- 70.75,25.07 L1.1
N$27
  Top 0.61: C19.1 67.63,29.85 U9.1
N$28
  Top 0.61: R35.2 63.29,28.31 C20.1 U9.3 R36.1
N$29
  Top 0.813: R33.1 34.56,14.57 R32.2 33.03,12.48 Q4.1
N$30
  Top 0.813: R33.2 34.54,20.02 U6.3
N$31
  Top 0.406: Q4.2 23.5,11.75 D8.A
  Top 0.813: CN2.2 28.77,8 LED3.- 24.15,8 D8.A
  pour Top: 30.02,5 31.39,5 32.18,5.79 32.18,7.16 28.88,10.46 28.65,10.69 28.65,16.71 22.12,16.71 22.12,5.99 24.79,5.99 24.79,6.91 25.3,7.42 27.61,7.42
N$32
  Top 0.813: R34.2 LED3.+
N$33
  Top 0.813: U7.2 38.17,18.7 R38.2
N$34
  Top 0.813: R40.1 49.5,14.52 R39.2 48.05,12.5 Q5.1
N$35
  Top 0.813: R40.2 49.48,19.58 U7.3
N$36
  Top 0.406: Q5.2 38.5,11.75 D9.A
  Top 0.813: CN3.2 43.82,7.95 LED4.- 39.1,7.95 D9.A
  pour Top: 45.09,4.93 46.38,4.93 47.35,5.89 47.35,6.88 43.76,10.46 43.76,16.74 37.19,16.74 37.19,6.05 39.8,6.05 39.8,6.78 40.39,7.37 42.65,7.37
N$37
  Top 0.813: R41.2 41.66,4.93 LED4.+
N$38
  Top 0.406: R37.2 64.96,25.93 U9.4
RESET  (via drill 0.3)
  Top 0.406: RST.P$2 25,49.77 ISP.3 | v43.51,51.26 46.35,51.26 C8.2 49.17,50.17 R2.2 v49.18,51.18 v49.17,51.18 | U2.29 52.56,39.94 v52.83,40.21
  Bottom 0.406: v43.51,51.26 26.42,51.26 RST.P$2 | v49.17,51.18 49.17,50.39 54.23,45.34 54.23,41.6 v52.83,40.21
V3D3  (via drill 0.3)
  Top 0.254: v63.8,23.37 64.69,23.37 | L1.2 71.09,21.82 v70.92,22
  Top 0.406: U1.1 U1.4 U6.1 U6.4 U7.1 43.71,23.77 | 43.71,23.77 U7.4 U3.1 U3.4 | R42.2 64.69,23.37 64.69,24 R43.2 62.09,24.03 U3.4 | R18.1 43.89,23.95 43.71,23.77 | R35.1 61.83,28.2 U3.4 | C22.2 60.12,28.29 R35.1 | R35.1 61.74,29.84 C20.2 60.13,29.86 C21.2
  Bottom 0.254: 71.68,21.97 70.94,21.97 v70.92,22 70.16,22 v70.13,21.97 | v63.04,23.39 63.78,23.39 v63.8,23.37
  Bottom 1.27: v63.04,23.39 67.74,23.39 69.16,21.97 v70.13,21.97 71.68,21.97 v71.7,22
  pour Top: 8.69,24.84 42.57,24.84 43.33,25.6 43.33,27.13 44.53,27.13 44.53,25.65 45.34,24.84 59.11,24.84 59.66,25.4 59.66,30.45 62.28,30.45 62.28,25.02 62.71,24.59 65.15,24.59 65.15,21.79 64.03,21.79 64.03,22.23 63.53,22.73 8.69,22.73
  pour Top: 68.1,22.23 68.1,19.15 74.02,19.15 74.02,22.23
  pour Bottom: 62.08,24.33 72.54,24.33 72.54,21.18 62.1,21.18 62.08,21.18
VIN
  Top 0.254: 76.77,32.65 76.77,31.85 C1.1 75.55,29.02 C25.2 75.52,27.42 C10.2 75.53,17.44 73.94,15.85 SW1.COM2
  Top 0.406: SW1.COM1 SW1.COM2 | 76.77,32.65 DC.VIN0
  pour Top: 72.64,10.87 72.64,16.56 74.98,18.9 74.98,34.49 77.83,34.49 77.85,34.52 77.85,18.29 75.29,15.72 75.29,10.97 75.29,10.87
VSYS
  Top 0.254: 66.37,11.76 68.69,11.76 C18.2 71.22,11.58 SW1.CH1A | C17.2 66.36,15.1 66.22,15.24
  Top 0.406: 26.67,2.65 D8.C 15.8,2.65 | 26.67,2.65 31.04,2.65 | 31.04,2.65 D9.C 41.76,2.65 | 41.76,2.65 46.02,2.65 | 46.02,2.65 D7.C 57.96,2.65 | 57.96,2.65 61.42,2.65 CN4.1 | R34.1 26.61,2.71 26.67,2.65 | CN2.1 31,2.69 31.04,2.65 | R41.1 41.68,2.73 41.76,2.65 | CN3.1 46,2.67 46.02,2.65 | R30.1 57.85,2.77 57.96,2.65 | 66.22,14.25 66.22,15.24 R42.1 66.25,22.42 R43.1 66.25,24.04 R37.1 65.91,26.02 U9.5 | 66.22,14.25 66.22,11.91 | 66.22,11.91 66.22,7.45 | SW1.CH2A SW1.CH1A | 66.37,11.76 66.22,11.91 | 66.23,14.26 66.22,14.25 | D6.C 11.4,2.65 | 11.4,2.65 15.8,2.65 | R16.1 11.4,3.38 11.4,2.65 | CN1.1 16,2.85 15.8,2.65
  Top 0.813: CN4.1 64.75,3.23 66.22,4.7 66.22,7.45
  pour Top: 65.61,28.02 65.61,5.64 64.01,4.04 7.49,4.04 7.49,1.14 65.41,1.14 67.41,3.15 67.41,25.63 66.27,26.77 66.27,28.02
  pour Top: 72.09,15.57 68.15,15.57 67.41,16.31 66.8,16.31 66.8,10.44 67.28,10.44 67.92,11.07 71.96,11.07 72.09,11.07
XTAL1
  Top 0.406: U2.7 44.24,45.47 R1.2 43.76,45.95 Y1.1
XTAL2
  Top 0.406: U2.8 43.44,44.74 R1.1 41.76,46.43 Y1.3

### Text on the board
tPlace: 3V3 | GND | RST | SCK | MISO | MOSI | U4 | ON | OFF | - | - | - | - | + | + | + | +
bPlace: DTR | TX | RX | GND | 3V3 | 3V3 | GND | RST | SCK | MISO | MOSI | RFM98W 433MHz | RFM95W 868MHz | RFM95W 915MHz | Lora- 4 Channel MOSFET Driver V1.1 | www.makerfabs.com | - | - | - | - | + | + | + | +